# Altium schematic sheet FPGA_BANKS.SchDoc
size A3; Organization: ICNS, MARCS Institute; Address1: Werrington South Campus, Great Western Highway; Address2: Werrington, NSW, 2747; SheetNumber: 5; SheetTotal: 16
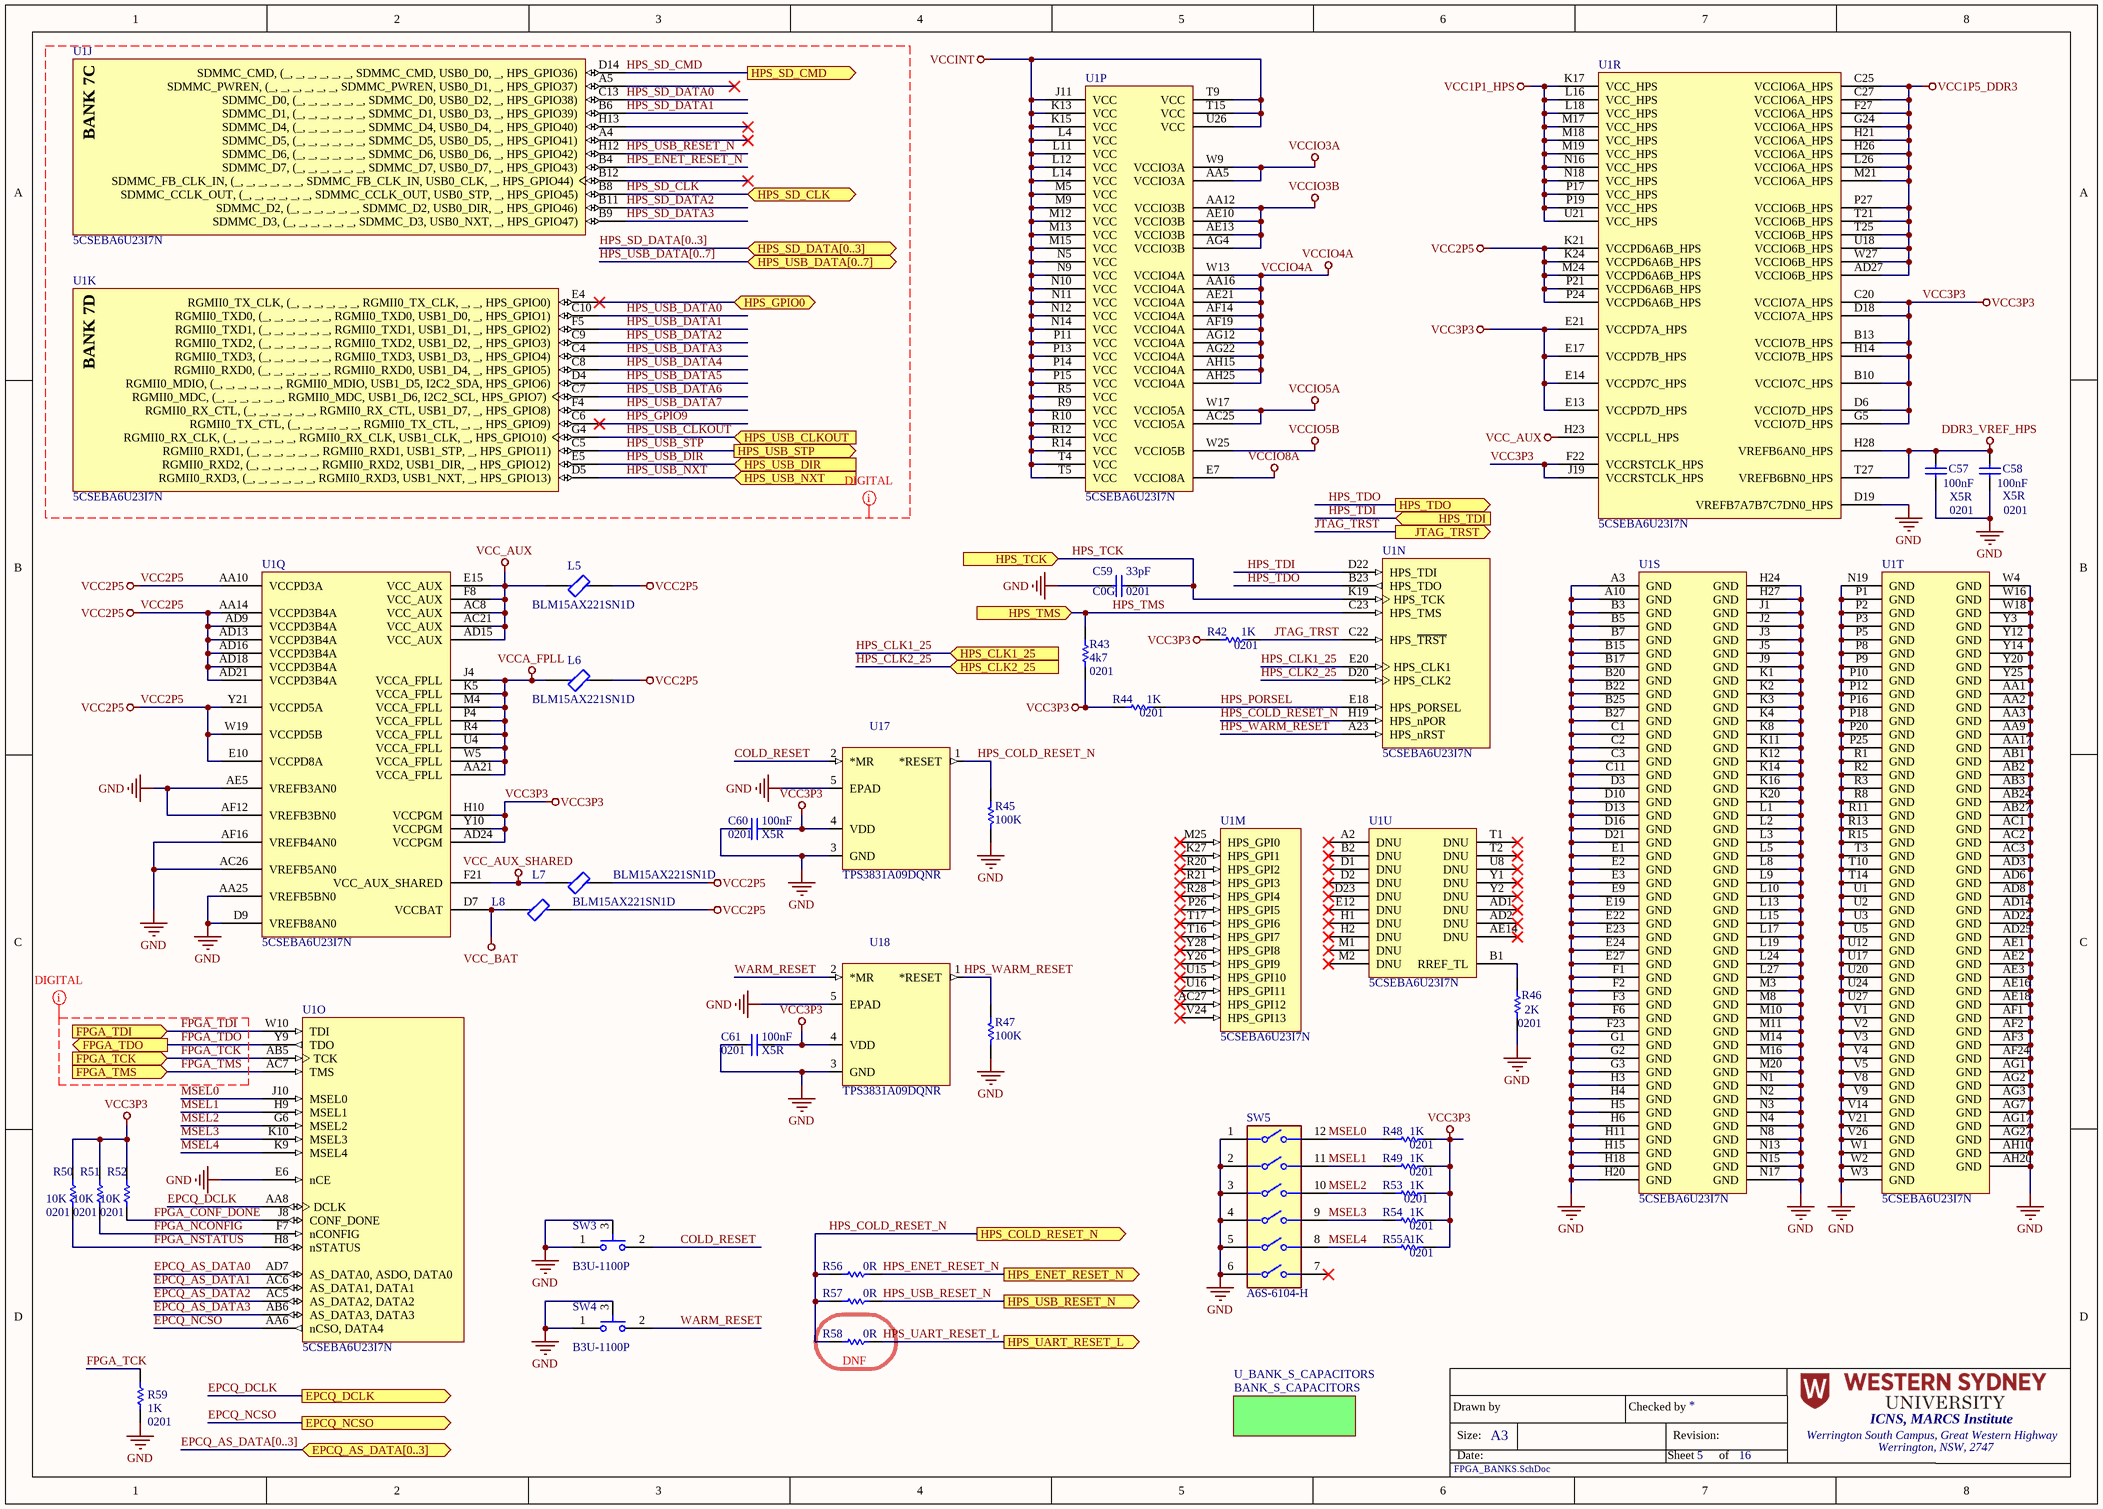
[diagram p0: FPGA_BANKS.SchDoc]

## Parts
C57  Capacitance: 100nF  Case Code (Imperial): 0201  Dielectric: X5R  [CAP 0201 (0603)]  (hidden comment: CL03A104KP3NNNC)
C58  Capacitance: 100nF  Case Code (Imperial): 0201  Dielectric: X5R  [CAP 0201 (0603)]  (hidden comment: CL03A104KP3NNNC)
C59  Capacitance: 33pF  Case Code (Imperial): 0201  Dielectric: C0G  [CAP 0201 (0603)]  (hidden comment: CGA1A2C0G1E330J030BA)
C60  Capacitance: 100nF  Case Code (Imperial): 0201  Dielectric: X5R  [CAP 0201 (0603)]  (hidden comment: CL03A104KP3NNNC)
C61  Capacitance: 100nF  Case Code (Imperial): 0201  Dielectric: X5R  [CAP 0201 (0603)]  (hidden comment: CL03A104KP3NNNC)
L5  BLM15AX221SN1D  [FP-BLM15-0_05-IPC_C]
L6  BLM15AX221SN1D  [FP-BLM15-0_05-IPC_C]
L7  BLM15AX221SN1D  [FP-BLM15-0_05-IPC_C]
L8  BLM15AX221SN1D  [FP-BLM15-0_05-IPC_C]
R42  value 1K  Case Code (Imperial): 0201  [RES 0201 (0603)]  (hidden comment: AC0201FR-071KL)
R43  value 4k7  Case Code (Imperial): 0201  [RES 0201 (0603)]  (hidden comment: AC0201FR-074K7L)
R44  value 1K  Case Code (Imperial): 0201  [RES 0201 (0603)]  (hidden comment: AC0201FR-071KL)
R45  value 100K  [RES 0402 (1005)]  (hidden comment: CRCW0402100KFKEDHP)
R46  value 2K  Case Code (Imperial): 0201  [RES 0201 (0603)]  (hidden comment: CRCW02012K00FKED)
R47  value 100K  [RES 0402 (1005)]  (hidden comment: CRCW0402100KFKEDHP)
R48  value 1K  Case Code (Imperial): 0201  [RES 0201 (0603)]  (hidden comment: AC0201FR-071KL)
R49  value 1K  Case Code (Imperial): 0201  [RES 0201 (0603)]  (hidden comment: AC0201FR-071KL)
R50  value 10K  Case Code (Imperial): 0201  [RES 0201 (0603)]  (hidden comment: AC0201FR-0710KL)
R51  value 10K  Case Code (Imperial): 0201  [RES 0201 (0603)]  (hidden comment: AC0201FR-0710KL)
R52  value 10K  Case Code (Imperial): 0201  [RES 0201 (0603)]  (hidden comment: AC0201FR-0710KL)
R53  value 1K  Case Code (Imperial): 0201  [RES 0201 (0603)]  (hidden comment: AC0201FR-071KL)
R54  value 1K  Case Code (Imperial): 0201  [RES 0201 (0603)]  (hidden comment: AC0201FR-071KL)
R55A  value 1K  Case Code (Imperial): 0201  [RES 0201 (0603)]  (hidden comment: AC0201FR-071KL)
R56  value 0R  [RES 0201 (0603)]  (hidden comment: AF0201JR-070RL)
R57  value 0R  [RES 0201 (0603)]  (hidden comment: AF0201JR-070RL)
R58  value 0R  [RES 0201 (0603)]  (hidden comment: AF0201JR-070RL)
R59  value 1K  Case Code (Imperial): 0201  [RES 0201 (0603)]  (hidden comment: AC0201FR-071KL)
SW3  B3U-1100P  [FP-B3U-1100P-MFG]
SW4  B3U-1100P  [FP-B3U-1100P-MFG]
SW5  A6S-6104-H  [FP-A6S-6104-H-MFG]
U1  5CSEBA6U23I7N  [ALTR-UBGA672_A-185]  (parts J,K,M,N,O,P,Q,R,S,T,U of 21)
U17  TPS3831A09DQNR  [DQN0004A_TEX]
U18  TPS3831A09DQNR  [DQN0004A_TEX]

## Blocks framed on the sheet
DNF: R58

## Sub-sheets
U_BANK_S_CAPACITORS = BANK_S_CAPACITORS: no entries

## Ports
EPCQ_AS_DATA[0..3] (bidir), EPCQ_DCLK (out), EPCQ_NCSO (out), FPGA_TCK (in), FPGA_TDI (in), FPGA_TDO (out), FPGA_TMS (in), HPS_CLK1_25 (in), HPS_CLK2_25 (in), HPS_COLD_RESET_N (out), HPS_ENET_RESET_N (out), HPS_GPIO0 (bidir), HPS_SD_CLK (bidir), HPS_SD_CMD (out), HPS_SD_DATA[0..3] (bidir), HPS_TCK (in), HPS_TDI (in), HPS_TDO (out), HPS_TMS (in), HPS_UART_RESET_L (out), HPS_USB_CLKOUT (in), HPS_USB_DATA[0..7] (bidir), HPS_USB_DIR (in), HPS_USB_NXT (in), HPS_USB_RESET_N (out), HPS_USB_STP (out), JTAG_TRST (out)

## Nets
DDR3_VREF_HPS: C57.2 C58.2 U1.H28(VREFB6AN0_HPS) U1.T27(VREFB6BN0_HPS)
GND: C57.1 C58.1 C59.2 C60.1 C61.1 R45.1 R46.2 R47.1 R59.2 SW3.1 SW3.3 SW4.1 SW4.3 SW5.1 SW5.2 SW5.3 SW5.4 SW5.5 SW5.6 U1.A3(GND) U1.A10(GND) U1.AA1(GND) U1.AA2(GND) U1.AA3(GND) U1.AA9(GND) U1.AA17(GND) U1.AA25(VREFB5BN0) U1.AB1(GND) U1.AB2(GND) U1.AB3(GND) U1.AB24(GND) U1.AB27(GND) U1.AC1(GND) U1.AC2(GND) U1.AC3(GND) U1.AC26(VREFB5AN0) U1.AD3(GND) U1.AD6(GND) U1.AD8(GND) U1.AD14(GND) U1.AD22(GND) U1.AD25(GND) U1.AE1(GND) U1.AE2(GND) U1.AE3(GND) U1.AE5(VREFB3AN0) U1.AE16(GND) U1.AE18(GND) U1.AF1(GND) U1.AF2(GND) U1.AF3(GND) U1.AF12(VREFB3BN0) U1.AF16(VREFB4AN0) U1.AF24(GND) U1.AG1(GND) U1.AG2(GND) U1.AG3(GND) U1.AG7(GND) U1.AG17(GND) U1.AG27(GND) U1.AH10(GND) U1.AH20(GND) U1.B3(GND) U1.B5(GND) U1.B7(GND) U1.B15(GND) U1.B17(GND) U1.B20(GND) U1.B22(GND) U1.B25(GND) U1.B27(GND) U1.C1(GND) U1.C2(GND) U1.C3(GND) U1.C11(GND) U1.D3(GND) U1.D9(VREFB8AN0) U1.D10(GND) U1.D13(GND) U1.D16(GND) U1.D19(VREFB7A7B7C7DN0_HPS) U1.D21(GND) U1.E1(GND) U1.E2(GND) U1.E3(GND) U1.E6(nCE) U1.E9(GND) U1.E19(GND) U1.E22(GND) U1.E23(GND) U1.E24(GND) U1.E27(GND) U1.F1(GND) U1.F2(GND) U1.F3(GND) U1.F6(GND) U1.F23(GND) U1.G1(GND) U1.G2(GND) U1.G3(GND) U1.H3(GND) U1.H4(GND) U1.H5(GND) U1.H6(GND) U1.H11(GND) U1.H15(GND) U1.H18(GND) U1.H20(GND) U1.H24(GND) U1.H27(GND) U1.J1(GND) U1.J2(GND) U1.J3(GND) U1.J5(GND) U1.J9(GND) U1.K1(GND) U1.K2(GND) U1.K3(GND) U1.K4(GND) U1.K8(GND) U1.K11(GND) U1.K12(GND) U1.K14(GND) U1.K16(GND) U1.K20(GND) U1.L1(GND) U1.L2(GND) U1.L3(GND) U1.L5(GND) U1.L8(GND) U1.L9(GND) U1.L10(GND) U1.L13(GND) U1.L15(GND) U1.L17(GND) U1.L19(GND) U1.L24(GND) U1.L27(GND) U1.M3(GND) U1.M8(GND) U1.M10(GND) U1.M11(GND) U1.M14(GND) U1.M16(GND) U1.M20(GND) U1.N1(GND) U1.N2(GND) U1.N3(GND) U1.N4(GND) U1.N8(GND) U1.N13(GND) U1.N15(GND) U1.N17(GND) U1.N19(GND) U1.P1(GND) U1.P2(GND) U1.P3(GND) U1.P5(GND) U1.P8(GND) U1.P9(GND) U1.P10(GND) U1.P12(GND) U1.P16(GND) U1.P18(GND) U1.P20(GND) U1.P25(GND) U1.R1(GND) U1.R2(GND) U1.R3(GND) U1.R8(GND) U1.R11(GND) U1.R13(GND) U1.R15(GND) U1.T3(GND) U1.T10(GND) U1.T14(GND) U1.U1(GND) U1.U2(GND) U1.U3(GND) U1.U5(GND) U1.U12(GND) U1.U17(GND) U1.U20(GND) U1.U24(GND) U1.U27(GND) U1.V1(GND) U1.V2(GND) U1.V3(GND) U1.V4(GND) U1.V5(GND) U1.V8(GND) U1.V9(GND) U1.V14(GND) U1.V21(GND) U1.V26(GND) U1.W1(GND) U1.W2(GND) U1.W3(GND) U1.W4(GND) U1.W16(GND) U1.W18(GND) U1.Y3(GND) U1.Y12(GND) U1.Y14(GND) U1.Y20(GND) U1.Y25(GND) U17.3(GND) U17.5(EPAD) U18.3(GND) U18.5(EPAD)
VCC1P1_HPS: U1.K17(VCC_HPS) U1.L16(VCC_HPS) U1.L18(VCC_HPS) U1.M17(VCC_HPS) U1.M18(VCC_HPS) U1.M19(VCC_HPS) U1.N16(VCC_HPS) U1.N18(VCC_HPS) U1.P17(VCC_HPS) U1.P19(VCC_HPS) U1.U21(VCC_HPS)
VCC1P5_DDR3: U1.AD27(VCCIO6B_HPS) U1.C25(VCCIO6A_HPS) U1.C27(VCCIO6A_HPS) U1.F27(VCCIO6A_HPS) U1.G24(VCCIO6A_HPS) U1.H21(VCCIO6A_HPS) U1.H26(VCCIO6A_HPS) U1.L26(VCCIO6A_HPS) U1.M21(VCCIO6A_HPS) U1.P27(VCCIO6B_HPS) U1.T21(VCCIO6B_HPS) U1.T25(VCCIO6B_HPS) U1.U18(VCCIO6B_HPS) U1.W27(VCCIO6B_HPS)
VCC2P5: L5.2 L6.2 L7.2 L8.2 U1.AA10(VCCPD3A) U1.AA14(VCCPD3B4A) U1.AD9(VCCPD3B4A) U1.AD13(VCCPD3B4A) U1.AD16(VCCPD3B4A) U1.AD18(VCCPD3B4A) U1.AD21(VCCPD3B4A) U1.E10(VCCPD8A) U1.K21(VCCPD6A6B_HPS) U1.K24(VCCPD6A6B_HPS) U1.M24(VCCPD6A6B_HPS) U1.P21(VCCPD6A6B_HPS) U1.P24(VCCPD6A6B_HPS) U1.W19(VCCPD5B) U1.Y21(VCCPD5A)
VCC3P3: C60.2 C61.2 R42.1 R43.2 R44.1 R48.2 R49.2 R50.2 R51.2 R52.2 R53.2 R54.2 R55A.2 U1.AD24(VCCPGM) U1.B10(VCCIO7C_HPS) U1.B13(VCCIO7B_HPS) U1.C20(VCCIO7A_HPS) U1.D6(VCCIO7D_HPS) U1.D18(VCCIO7A_HPS) U1.E13(VCCPD7D_HPS) U1.E14(VCCPD7C_HPS) U1.E17(VCCPD7B_HPS) U1.E21(VCCPD7A_HPS) U1.F22(VCCRSTCLK_HPS) U1.G5(VCCIO7D_HPS) U1.H10(VCCPGM) U1.H14(VCCIO7B_HPS) U1.J19(VCCRSTCLK_HPS) U1.Y10(VCCPGM) U17.4(VDD) U18.4(VDD)
VCC_AUX: L5.1 U1.AC8(VCC_AUX) U1.AC21(VCC_AUX) U1.AD15(VCC_AUX) U1.E15(VCC_AUX) U1.F8(VCC_AUX) U1.H23(VCCPLL_HPS)
VCC_AUX_SHARED: L7.1 U1.F21(VCC_AUX_SHARED)
VCC_BAT: L8.1 U1.D7(VCCBAT)
VCCA_FPLL: L6.1 U1.AA21(VCCA_FPLL) U1.J4(VCCA_FPLL) U1.K5(VCCA_FPLL) U1.M4(VCCA_FPLL) U1.P4(VCCA_FPLL) U1.R4(VCCA_FPLL) U1.U4(VCCA_FPLL) U1.W5(VCCA_FPLL)
VCCINT: U1.J11(VCC) U1.K13(VCC) U1.K15(VCC) U1.L4(VCC) U1.L11(VCC) U1.L12(VCC) U1.L14(VCC) U1.M5(VCC) U1.M9(VCC) U1.M12(VCC) U1.M13(VCC) U1.M15(VCC) U1.N5(VCC) U1.N9(VCC) U1.N10(VCC) U1.N11(VCC) U1.N12(VCC) U1.N14(VCC) U1.P11(VCC) U1.P13(VCC) U1.P14(VCC) U1.P15(VCC) U1.R5(VCC) U1.R9(VCC) U1.R10(VCC) U1.R12(VCC) U1.R14(VCC) U1.T4(VCC) U1.T5(VCC) U1.T9(VCC) U1.T15(VCC) U1.U26(VCC)
VCCIO3A: U1.AA5(VCCIO3A) U1.W9(VCCIO3A)
VCCIO3B: U1.AA12(VCCIO3B) U1.AE10(VCCIO3B) U1.AE13(VCCIO3B) U1.AG4(VCCIO3B)
VCCIO4A: U1.AA16(VCCIO4A) U1.AE21(VCCIO4A) U1.AF14(VCCIO4A) U1.AF19(VCCIO4A) U1.AG12(VCCIO4A) U1.AG22(VCCIO4A) U1.AH15(VCCIO4A) U1.AH25(VCCIO4A) U1.W13(VCCIO4A)
VCCIO5A: U1.AC25(VCCIO5A) U1.W17(VCCIO5A)
VCCIO5B: U1.W25(VCCIO5B)
VCCIO8A: U1.E7(VCCIO8A)
COLD_RESET: SW3.2 U17.2(*MR)
EPCQ_AS_DATA0: U1.AD7(AS_DATA0,_ASDO,_DATA0)
EPCQ_AS_DATA1: U1.AC6(AS_DATA1,_DATA1)
EPCQ_AS_DATA2: U1.AC5(AS_DATA2,_DATA2)
EPCQ_AS_DATA3: U1.AB6(AS_DATA3,_DATA3)
EPCQ_DCLK: U1.AA8(DCLK) ; port EPCQ_DCLK
EPCQ_NCSO: U1.AA6(nCSO,_DATA4) ; port EPCQ_NCSO
FPGA_CONF_DONE: R52.1 U1.J8(CONF_DONE)
FPGA_NCONFIG: R51.1 U1.F7(nCONFIG)
FPGA_NSTATUS: R50.1 U1.H8(nSTATUS)
FPGA_TCK: R59.1 U1.AB5(TCK) ; port FPGA_TCK
FPGA_TDI: U1.W10(TDI) ; port FPGA_TDI
FPGA_TDO: U1.Y9(TDO) ; port FPGA_TDO
FPGA_TMS: U1.AC7(TMS) ; port FPGA_TMS
HPS_CLK1_25: U1.E20(HPS_CLK1) ; port HPS_CLK1_25
HPS_CLK2_25: U1.D20(HPS_CLK2) ; port HPS_CLK2_25
HPS_COLD_RESET_N: R45.2 R56.1 R57.1 R58.1 U1.H19(HPS_nPOR) U17.1(*RESET) ; port HPS_COLD_RESET_N
HPS_ENET_RESET_N: R56.2 U1.B4(SDMMC_D7,_(_,__,__,__,__,__,_SDMMC_D7,_USB0_D7,__,_HPS_GPIO43)) ; port HPS_ENET_RESET_N
HPS_GPIO0: U1.E4(RGMII0_TX_CLK,_(_,__,__,__,__,__,_RGMII0_TX_CLK,__,__,_HPS_GPIO0)) ; port HPS_GPIO0
HPS_GPIO9: U1.C6(RGMII0_TX_CTL,_(_,__,__,__,__,__,_RGMII0_TX_CTL,__,__,_HPS_GPIO9))
HPS_PORSEL: R44.2 U1.E18(HPS_PORSEL)
HPS_SD_CLK: U1.B8(SDMMC_CCLK_OUT,_(_,__,__,__,__,__,_SDMMC_CCLK_OUT,_USB0_STP,__,_HPS_GPIO45)) ; port HPS_SD_CLK
HPS_SD_CMD: U1.D14(SDMMC_CMD,_(_,__,__,__,__,__,_SDMMC_CMD,_USB0_D0,__,_HPS_GPIO36)) ; port HPS_SD_CMD
HPS_SD_DATA0: U1.C13(SDMMC_D0,_(_,__,__,__,__,__,_SDMMC_D0,_USB0_D2,__,_HPS_GPIO38))
HPS_SD_DATA1: U1.B6(SDMMC_D1,_(_,__,__,__,__,__,_SDMMC_D1,_USB0_D3,__,_HPS_GPIO39))
HPS_SD_DATA2: U1.B11(SDMMC_D2,_(_,__,__,__,__,__,_SDMMC_D2,_USB0_DIR,__,_HPS_GPIO46))
HPS_SD_DATA3: U1.B9(SDMMC_D3,_(_,__,__,__,__,__,_SDMMC_D3,_USB0_NXT,__,_HPS_GPIO47))
HPS_TCK: C59.1 U1.K19(HPS_TCK) ; port HPS_TCK
HPS_TDI: U1.D22(HPS_TDI) ; port HPS_TDI
HPS_TDO: U1.B23(HPS_TDO) ; port HPS_TDO
HPS_TMS: R43.1 U1.C23(HPS_TMS) ; port HPS_TMS
HPS_UART_RESET_L: R58.2 ; port HPS_UART_RESET_L
HPS_USB_CLKOUT: U1.G4(RGMII0_RX_CLK,_(_,__,__,__,__,__,_RGMII0_RX_CLK,_USB1_CLK,__,_HPS_GPIO10)) ; port HPS_USB_CLKOUT
HPS_USB_DATA0: U1.C10(RGMII0_TXD0,_(_,__,__,__,__,__,_RGMII0_TXD0,_USB1_D0,__,_HPS_GPIO1))
HPS_USB_DATA1: U1.F5(RGMII0_TXD1,_(_,__,__,__,__,__,_RGMII0_TXD1,_USB1_D1,__,_HPS_GPIO2))
HPS_USB_DATA2: U1.C9(RGMII0_TXD2,_(_,__,__,__,__,__,_RGMII0_TXD2,_USB1_D2,__,_HPS_GPIO3))
HPS_USB_DATA3: U1.C4(RGMII0_TXD3,_(_,__,__,__,__,__,_RGMII0_TXD3,_USB1_D3,__,_HPS_GPIO4))
HPS_USB_DATA4: U1.C8(RGMII0_RXD0,_(_,__,__,__,__,__,_RGMII0_RXD0,_USB1_D4,__,_HPS_GPIO5))
HPS_USB_DATA5: U1.D4(RGMII0_MDIO,_(_,__,__,__,__,__,_RGMII0_MDIO,_USB1_D5,_I2C2_SDA,_HPS_GPIO6))
HPS_USB_DATA6: U1.C7(RGMII0_MDC,_(_,__,__,__,__,__,_RGMII0_MDC,_USB1_D6,_I2C2_SCL,_HPS_GPIO7))
HPS_USB_DATA7: U1.F4(RGMII0_RX_CTL,_(_,__,__,__,__,__,_RGMII0_RX_CTL,_USB1_D7,__,_HPS_GPIO8))
HPS_USB_DIR: U1.E5(RGMII0_RXD2,_(_,__,__,__,__,__,_RGMII0_RXD2,_USB1_DIR,__,_HPS_GPIO12)) ; port HPS_USB_DIR
HPS_USB_NXT: U1.D5(RGMII0_RXD3,_(_,__,__,__,__,__,_RGMII0_RXD3,_USB1_NXT,__,_HPS_GPIO13)) ; port HPS_USB_NXT
HPS_USB_RESET_N: R57.2 U1.H12(SDMMC_D6,_(_,__,__,__,__,__,_SDMMC_D6,_USB0_D6,__,_HPS_GPIO42)) ; port HPS_USB_RESET_N
HPS_USB_STP: U1.C5(RGMII0_RXD1,_(_,__,__,__,__,__,_RGMII0_RXD1,_USB1_STP,__,_HPS_GPIO11)) ; port HPS_USB_STP
HPS_WARM_RESET: R47.2 U1.A23(HPS_nRST) U18.1(*RESET)
JTAG_TRST: R42.2 U1.C22(HPS_~{TRST}) ; port JTAG_TRST
MSEL0: R48.1 SW5.12 U1.J10(MSEL0)
MSEL1: R49.1 SW5.11 U1.H9(MSEL1)
MSEL2: R53.1 SW5.10 U1.G6(MSEL2)
MSEL3: R54.1 SW5.9 U1.K10(MSEL3)
MSEL4: R55A.1 SW5.8 U1.K9(MSEL4)
WARM_RESET: SW4.2 U18.2(*MR)
NetR46_1: R46.1 U1.B1(RREF_TL)

Not connected (* = marked no-connect by the designer): SW5 7*; U1 A2(DNU)* A4(SDMMC_D5,_(_,__,__,__,__,__,_SDMMC_D5,_USB0_D5,__,_HPS_GPIO41))* A5(SDMMC_PWREN,_(_,__,__,__,__,__,_SDMMC_PWREN,_USB0_D1,__,_HPS_GPIO37))* AC27(HPS_GPI12)* AD1(DNU)* AD2(DNU)* AE14(DNU)* B2(DNU)* B12(SDMMC_FB_CLK_IN,_(_,__,__,__,__,__,_SDMMC_FB_CLK_IN,_USB0_CLK,__,_HPS_GPIO44))* D1(DNU)* D2(DNU)* D23(DNU)* E12(DNU)* H1(DNU)* H2(DNU)* H13(SDMMC_D4,_(_,__,__,__,__,__,_SDMMC_D4,_USB0_D4,__,_HPS_GPIO40))* K27(HPS_GPI1)* M1(DNU)* M2(DNU)* M25(HPS_GPI0)* P26(HPS_GPI5)* R20(HPS_GPI2)* R21(HPS_GPI3)* R28(HPS_GPI4)* T1(DNU)* T2(DNU)* T16(HPS_GPI7)* T17(HPS_GPI6)* U8(DNU)* U15(HPS_GPI10)* U16(HPS_GPI11)* V24(HPS_GPI13)* Y1(DNU)* Y2(DNU)* Y26(HPS_GPI9)* Y28(HPS_GPI8)*

## Buses and harness runs
bus EPCQ_AS_DATA[0..3] = port EPCQ_AS_DATA[0..3]
bus HPS_SD_DATA[0..3] = port HPS_SD_DATA[0..3]
bus HPS_USB_DATA[0..7] = port HPS_USB_DATA[0..7]

## Layout directives
net class DIGITAL: FPGA_TCK, FPGA_TDI, FPGA_TDO, FPGA_TMS, HPS_ENET_RESET_N, HPS_GPIO9, HPS_SD_CLK, HPS_SD_CMD, HPS_SD_DATA0, HPS_SD_DATA1, HPS_SD_DATA2, HPS_SD_DATA3, HPS_SD_DATA[0..3], HPS_USB_CLKOUT, HPS_USB_DATA0, HPS_USB_DATA1, HPS_USB_DATA2, HPS_USB_DATA3, HPS_USB_DATA4, HPS_USB_DATA5, HPS_USB_DATA6, HPS_USB_DATA7, HPS_USB_DATA[0..7], HPS_USB_DIR, HPS_USB_NXT, HPS_USB_RESET_N, HPS_USB_STP

## Notes on the sheet
- Drawn by
- Size:
- Date:
- A3
- Checked by
- Sheet
- Revision:
- of
- (in symbol CMP-005-000007-1, part J) BANK 7C
- (in symbol CMP-005-000007-1, part K) BANK 7D

## Library data of the parts
C57 C58 C60 C61 = CMP-003-000014-1: Cap Ceramic 0.1uF 10V X5R 10% Pad SMD 0201 85C T/R; Manufacturer: Samsung; RoHS: Yes; Manufacturer Part Number: CL03A104KP3NNNC; Tolerance: 10%; Height: 0.3mm; ComponentLink2Description: https://datasheet.ciiva.com/26838/getdatasheetpartid-357484-26838083.pdf?src-supplier=Verical; ComponentLink2URL: https://datasheet.ciiva.com/26838/getdatasheetpartid-357484-26838083.pdf?src-supplier=Verical; Lead Free: Lead Free; Category: Ceramic Capacitors; Voltage Rating: 10V; Value: 0.1uF; Source: ICNS_PropheseeLib.SchLib; Depth: 0.3mm; Mount: Surface Mount; Stock 1: 12175; Package Quantity: 1; Packaging: Tape and Reel; ComponentLink1Description: https://datasheet.ciiva.com/25803/cl03a104kp3nnnc-25803204.pdf?src-supplier=Digi-Key; Case Code (Metric): 0603; Width: 0.012inch; Length: 0.6mm; Radiation Hardening: No; Series: CL; Thickness: 0.013inch; Max Operating Temperature: 85°C; Design Item ID: CL03A104KP3NNNC; Voltage Rating (DC): 10V; Case/Package: 0201; Contact Plating: Tin; Min Operating Temperature: -55°C; Construction: Flat; Pricing 1: 1=0.10000, 10=0.02900, 50=0.01600, 100=0.01300, 500=0.00932, 1000=0.00732, 2500=0.00666, 5000=0.00612 (USD); ComponentLink1URL: https://datasheet.ciiva.com/25803/cl03a104kp3nnnc-25803204.pdf?src-supplier=Digi-Key
C59 = CMP-003-000013-1: Cap Ceramic 33 pF 25V ±5% C0G, NP0 0201 (0603 Metric); Manufacturer: TDK; Value: 33pF; Category: Ceramic Capacitors; Height: 0.3mm; Tolerance: 5%; RoHS: Yes; Manufacturer Part Number: CGA1A2C0G1E330J030BA; Voltage Rating: 25V; Package Quantity: 1; Weight: 6E-06oz; Packaging: Tape and Reel; RoHS Compliant: Yes; Length: 0.6mm; Mount: Surface Mount; Pricing 1: 1=0.11000, 10=0.08000, 50=0.04360, 100=0.03560, 500=0.02540, 1000=0.01996, 2500=0.01815, 5000=0.01670 (USD); Design Item ID: CGA1A2C0G1E330J030BA; ComponentLink1Description: https://datasheet.ciiva.com/24223/cga1a2c0g1e330j030ba-272981-24223848.pdf?src-supplier=Mouser; Min Operating Temperature: -55°C; Ratings: AEC-Q200; Stock 1: 26669; Max Operating Temperature: 125°C; Voltage Rating (DC): 25V; Series: CGA; ComponentLink1URL: https://datasheet.ciiva.com/24223/cga1a2c0g1e330j030ba-272981-24223848.pdf?src-supplier=Mouser; Source: ICNS_PropheseeLib.SchLib; Case Code (Metric): 0603; Thickness: 0.013inch; Width: 0.012inch; Depth: 0.3mm; Termination: SMD/SMT; Case/Package: 0201; Resistor Type: Ceramic
L5-L8 = CMP-005-000015-2: Ferrite Bead Multi-Layer 220 Ohms @ 100 MHz 0402 (1005 Metric) 600mA 180mOhm; Manufacturer: Murata; DC Resistance (DCR): 180mR; Number of Lines: 1; Material: Ferrite,Steel; Impedance: 220R; Test Frequency: 100MHz; Tolerance: 25%; Packaging: Tape and Reel; Case Code (Imperial): 0402; Current Rating: 600mA; Max Current Rating: 600mA; Min Operating Temperature: -55°C; Length: 1mm; Lead Free: Lead Free; Number of Circuits: 1; Package Quantity: 1; Max Operating Temperature: 125°C; Termination: SMD/SMT; Width: 0.5mm; REACH SVHC: No SVHC; Case/Package: 0402; Number of Pins: 2; Height: 0.5mm; Case Code (Metric): 1005; Max DC Current: 600mA; Depth: 0.5mm; DC Resistance-Max: 180MR; RoHS Compliant: Yes; Series: BLM15AX_SN; ComponentLink5URL: https://datasheet.ciiva.com/16420/l0110s0100blm15ax-sn-16420779.pdf?src-supplier=Future+Electronics; ComponentLink1Description: https://datasheet.ciiva.com/41449/001172168-da-01-en-drossel-0402-220r-1-0x0-5mm-10000st-41449455.pdf?src-supplier=Conrad; ComponentLink5Description: https://datasheet.ciiva.com/16420/l0110s0100blm15ax-sn-16420779.pdf?src-supplier=Future+Electronics; Design Item ID: BLM15AX221SN1D; ComponentLink3URL: https://datasheet.ciiva.com/1012/l0110e-1012305.pdf?src-supplier=Digi-Key; ComponentLink4URL: https://datasheet.ciiva.com/1012/l0110e-1012307.pdf?src-supplier=Digi-Key; RoHS: Yes; ComponentLink2Description: https://datasheet.ciiva.com/1012/l0110e-1012306.pdf?src-supplier=Digi-Key; Manufacturer Part Number: BLM15AX221SN1D; Pricing 1: 1=0.06640, 10=0.03530, 25=0.03490, 100=0.02120, 250=0.02100, 500=0.01870, 1000=0.01580, 3000=0.01510, 6000=0.01500, 15000=0.01490, 30000=0.01480 (USD); ComponentLink1URL: https://datasheet.ciiva.com/41449/001172168-da-01-en-drossel-0402-220r-1-0x0-5mm-10000st-41449455.pdf?src-supplier=Conrad; Source: ICNS_PropheseeLib.SchLib; ComponentLink3Description: https://datasheet.ciiva.com/1012/l0110e-1012305.pdf?src-supplier=Digi-Key; ComponentLink2URL: https://datasheet.ciiva.com/1012/l0110e-1012306.pdf?src-supplier=Digi-Key; ComponentLink4Description: https://datasheet.ciiva.com/1012/l0110e-1012307.pdf?src-supplier=Digi-Key; Stock 1: 29113; Category: Inductors
R42 R44 R48 R49 R53 R54 R55A R59 = CMP-006-000019-1: Res Thick Film 0201 1K Ohm 1% 0.05W(1/20W) ±200ppm/C Pad SMD Automotive T/R; Manufacturer: Yageo; Temperature Coefficient: 200ppm/°C; Max Power Dissipation: 50mW; Resistance: 1kR; Case Code (Metric): 0603; Width: 0.012inch; ComponentLink1Description: http://www.yageo.com/NewPortal/yageodocoutput?fileName=/pdf/R-Chip/PYu-AC_51_RoHS_L_6.pdf&src-supplier=Digi-Key; Tolerance: 1%; Source: ICNS_PropheseeLib.SchLib; Manufacturer Part Number: AC0201FR-071KL; Resistor Type: Thick Film; ComponentLink1URL: http://www.yageo.com/NewPortal/yageodocoutput?fileName=/pdf/R-Chip/PYu-AC_51_RoHS_L_6.pdf&src-supplier=Digi-Key; Packaging: Tape and Reel; Max Operating Temperature: 155°C; Min Operating Temperature: -55°C; Height: 0.01inch; Pricing 1: 1=0.10000, 10=0.06600, 100=0.02670, 1000=0.01201, 2500=0.01042, 5000=0.00861 (USD); Case/Package: 0201; Category: Chip SMD Resistors; Stock 1: 200; Length: 0.024inch; Design Item ID: AC0201FR-071KL; Features: Moisture Resistant,Automotive AEC-Q200; RoHS: Yes; Number of Terminations: 2
R43 = CMP-006-000022-1: Res Thick Film 0201 4.7K Ohm 1% 1/20W ±200ppm/°C Molded SMD Paper T/R; Manufacturer: Yageo; Max Power Dissipation: 50mW; Resistance: 4.7kR; Number of Terminations: 2; Packaging: Tape and Reel; RoHS: Yes; Temperature Coefficient: 200ppm/°C; Case Code (Metric): 0603; Features: Moisture Resistant,Automotive AEC-Q200; Source: ICNS_PropheseeLib.SchLib; Case/Package: 0201; Pricing 1: 1=0.10000, 10=0.06600, 100=0.02670, 1000=0.01201, 2500=0.01042, 5000=0.00861 (USD); Min Operating Temperature: -55°C; Length: 0.024inch; Stock 1: 267560; ComponentLink1URL: http://www.yageo.com/NewPortal/yageodocoutput?fileName=/pdf/R-Chip/PYu-AC_51_RoHS_L_6.pdf&src-supplier=Digi-Key; Height: 0.01inch; Manufacturer Part Number: AC0201FR-074K7L; Lead Free: Lead Free; ComponentLink1Description: http://www.yageo.com/NewPortal/yageodocoutput?fileName=/pdf/R-Chip/PYu-AC_51_RoHS_L_6.pdf&src-supplier=Digi-Key; Design Item ID: AC0201FR-074K7L; Width: 0.012inch; Category: Chip SMD Resistors; Resistor Type: Thick Film; Tolerance: 1%; Max Operating Temperature: 155°C
R45 R47 = CMP-006-000009-1: Res Thick Film 0402 100K Ohm 1% 0.2W(1/5W) ±100ppm/C Pad SMD Automotive T/R; Manufacturer 1: Vishay Dale; Resistance: 100kR; Temperature Coefficient: 100ppm/°C; Max Power Dissipation: 125mW; Voltage Rating (DC): 50V; ComponentLink1URL: https://datasheet.ciiva.com/2498/crcwhpe3-2498716.pdf?src-supplier=Digi-Key; ComponentLink5URL: https://datasheet.ciiva.com/48525/crcwhpe3-48525582.pdf?src-supplier=Avnet; Tolerance: 1%; Height: 0.3mm; Features: Automotive AEC-Q200; Mount: Surface Mount; RoHS: Yes; Series: CRCW-HP; Lead Free: Lead Free; REACH SVHC: Unknown; Case Code (Metric): 1005; ComponentLink7Description: https://datasheet.ciiva.com/46441/1703058-46441599.pdf?src-supplier=Element14; RoHS Compliant: Yes; Weight: 2.3E-05oz; Packaging: Tape and Reel; Min Operating Temperature: -55°C; Width: 0.02inch; Package Quantity: 10; ComponentLink3URL: https://datasheet.ciiva.com/2498/crcwhpe3-2498718.pdf?src-supplier=Digi-Key; Design Item ID: CRCW0402100KFKEDHP; ComponentLink4Description: https://datasheet.ciiva.com/8982/crcwhpe3-8982553.pdf?src-supplier=Avnet; Resistor Type: Thick Film; Contact Plating: Tin; ComponentLink6Description: https://datasheet.ciiva.com/5548/crcwhpe3-46056-5548557.pdf?src-supplier=Mouser; ComponentLink3Description: https://datasheet.ciiva.com/2498/crcwhpe3-2498718.pdf?src-supplier=Digi-Key; Termination: SMD/SMT; Pricing 1: 10000=0.01543 (USD); ComponentLink5Description: https://datasheet.ciiva.com/48525/crcwhpe3-48525582.pdf?src-supplier=Avnet; Length: 1mm; Max Operating Temperature: 155°C; Case Code (Imperial): 0402; ComponentLink2URL: https://datasheet.ciiva.com/2498/crcwhpe3-2498717.pdf?src-supplier=Digi-Key; ComponentLink6URL: https://datasheet.ciiva.com/5548/crcwhpe3-46056-5548557.pdf?src-supplier=Mouser; ComponentLink2Description: https://datasheet.ciiva.com/2498/crcwhpe3-2498717.pdf?src-supplier=Digi-Key; Radiation Hardening: No; Resistance Tolerance: 1%; Description 1: Res Thick Film 0402 100K Ohm 1% 0.2W(1/5W) ±100ppm/C Pad SMD Automotive T/R; ComponentLink7URL: https://datasheet.ciiva.com/46441/1703058-46441599.pdf?src-supplier=Element14; Power Rating: 125mW; Source: ICNS_PropheseeLib.SchLib; Category: Chip SMD Resistors; Voltage Rating: 50V; Number of Terminations: 2; Stock 1: 96553; Manufacturer Part Number 1: CRCW0402100KFKEDHP; ComponentLink1Description: https://datasheet.ciiva.com/2498/crcwhpe3-2498716.pdf?src-supplier=Digi-Key; ComponentLink4URL: https://datasheet.ciiva.com/8982/crcwhpe3-8982553.pdf?src-supplier=Avnet; Technology: THICK FILM; Case/Package: 0402; Depth: 0.5mm
R46 = CMP-006-000024-1: Res Thick Film 0201 2K Ohm 1% 1/20W ±100ppm/°C Molded SMD SMD Paper T/R; Manufacturer: Vishay Dale; Resistance: 2kR; Voltage Rating: 30V; Power Rating: 50mW; Pricing 1: 1=0.28000, 10=0.24000, 100=0.09400, 1000=0.03933, 2500=0.03605, 5000=0.03278 (USD); Source: ICNS_PropheseeLib.SchLib; Temperature Coefficient: 100ppm/°C; Case/Package: 0201; Case Code (Metric): 0603; Series: CRCW; Category: Chip SMD Resistors; ComponentLink1URL: https://datasheet.ciiva.com/3255/crcw0201e3-3255934.pdf?src-supplier=Avnet; Packaging: Tape and Reel; Height: 0.23mm; Max Operating Temperature: 155°C; Radiation Hardening: No; Width: 0.3mm; Resistor Type: Thick Film; Termination: SMD/SMT; Min Operating Temperature: -55°C; Design Item ID: CRCW02012K00FKED; Construction: Rectangular; Military Standard: Not; Number of Terminations: 2; Depth: 0.3mm; RoHS Compliant: Yes; Lead Free: Lead Free; Manufacturer Part Number: CRCW02012K00FKED; Tolerance: 1%; ComponentLink1Description: https://datasheet.ciiva.com/3255/crcw0201e3-3255934.pdf?src-supplier=Avnet; Stock 1: 17990; Contact Plating: Tin; Voltage Rating (DC): 30V; Length: 0.6mm; Weight: 6E-06oz; Max Power Dissipation: 50mW; RoHS: Yes
R50-R52 = CMP-006-000021-1: Res Thick Film 0201 10K Ohm 1% 0.05W(1/20W) ±200ppm/C Pad SMD Automotive T/R; Manufacturer: Yageo; Max Power Dissipation: 50mW; Resistance: 10kR; Temperature Coefficient: 200ppm/°C; Length: 0.024inch; Packaging: Tape and Reel; ComponentLink1URL: http://www.yageo.com/NewPortal/yageodocoutput?fileName=/pdf/R-Chip/PYu-AC_51_RoHS_L_6.pdf&src-supplier=Digi-Key; Number of Terminations: 2; Case/Package: 0201; Source: ICNS_PropheseeLib.SchLib; Case Code (Metric): 0603; Manufacturer Part Number: AC0201FR-0710KL; ComponentLink1Description: http://www.yageo.com/NewPortal/yageodocoutput?fileName=/pdf/R-Chip/PYu-AC_51_RoHS_L_6.pdf&src-supplier=Digi-Key; Min Operating Temperature: -55°C; Category: Chip SMD Resistors; Width: 0.012inch; RoHS: Yes; Max Operating Temperature: 155°C; Features: Moisture Resistant,Automotive AEC-Q200; Pricing 1: 1=0.10000, 10=0.06600, 100=0.02670, 1000=0.01201, 2500=0.01042, 5000=0.00861 (USD); Resistor Type: Thick Film; Stock 1: 698280; Design Item ID: AC0201FR-0710KL; Height: 0.01inch; Tolerance: 1%
R56-R58 = CMP-006-000020-1: Res Thick Film 0201 0 Ohm Sulfur Resistant Pad SMD Automotive T/R; Manufacturer: Yageo; Max Power Dissipation: 50mW; Resistance: 0mR; RoHS: Yes; Case/Package: 0201; Case Code (Metric): 0603; Case Code (Imperial): 0201; Min Operating Temperature: -55°C; Max Operating Temperature: 125°C; Number of Terminations: 2; Width: 0.012inch; ComponentLink1URL: http://www.mouser.com/ds/2/447/PYu-AF_51_RoHS_L_5-1085711.pdf?src-supplier=Mouser; ComponentLink1Description: http://www.mouser.com/ds/2/447/PYu-AF_51_RoHS_L_5-1085711.pdf?src-supplier=Mouser; ComponentLink2URL: http://www.yageo.com/documents/recent/PYu-AF_51_RoHS_L_5.pdf?src-supplier=Digi-Key; ComponentLink2Description: http://www.yageo.com/documents/recent/PYu-AF_51_RoHS_L_5.pdf?src-supplier=Digi-Key; Stock 1: 50009; Pricing 1: 1=0.11000, 10=0.09500, 25=0.06560, 50=0.05100, 100=0.03640, 250=0.02840, 500=0.02256, 1000=0.01602, 5000=0.01238 (USD); Features: Moisture Resistant,Anti-Sulfur; Package Quantity: 10000; Packaging: Tape and Reel; Length: 0.024inch; Height: 0.01inch; Termination: SMD/SMT; Design Item ID: AF0201JR-070RL; Weight: 6E-06oz; RoHS Compliant: Yes; Resistor Type: Thick Film; Source: ICNS_PropheseeLib.SchLib; Manufacturer Part Number: AF0201JR-070RL; Category: Chip SMD Resistors
SW3 SW4 = CMP-012-000002-1: Switch Tactile N.O. SPST Round Button Gull Wing 0.05A 12VDC 1.5N SMD Embossed T/R; Manufacturer: Omron; Current Rating: 50mA; Voltage Rating (DC): 12V; Electrical Life: 200000Cycles; Actuator Length: 0.4mm; Actuator Type: Standard; Switch Travel: 0.15mm; Contact Resistance: 100mR; Ratings: Dust Proof; Illumination Type: Non-Illuminated,Illuminated; Switch Function: Off-Mom; RoHS Compliant: Yes; Max Operating Temperature: 70°C; Min Operating Temperature: -25°C; Throw Configuration: SPST; Max Current Rating: 50mA; ComponentLink3URL: https://datasheet.ciiva.com/2901/b3u-1110-2901098.pdf?src-supplier=Digi-Key; ComponentLink5URL: https://datasheet.ciiva.com/22696/60838-22696216.pdf?src-supplier=Element14; Contact Plating: Silver; Design Item ID: B3U-1100P; REACH SVHC: Unknown; ComponentLink2Description: https://datasheet.ciiva.com/2901/b3u-1110-2901097.pdf?src-supplier=Digi-Key; ComponentLink9URL: https://datasheet.ciiva.com/1532/60838-1532684.pdf?src-supplier=Element14; Package Quantity: 1; Contact Current Rating: 50mA; Max Voltage Rating (DC): 12V; Mechanical Life: 200000Cycles; Length: 3.15mm; Packaging: Tape and Reel; ComponentLink8URL: https://datasheet.ciiva.com/16155/en-b3u-16155023.pdf?src-supplier=Onlinecomponents.com; ComponentLink6Description: https://datasheet.ciiva.com/14142/b3u-eng-datasheet-14142541.pdf?src-supplier=Distrelec; ComponentLink9Description: https://datasheet.ciiva.com/1532/60838-1532684.pdf?src-supplier=Element14; Source: ICNS_PropheseeLib.SchLib; ComponentLink1URL: https://datasheet.ciiva.com/1634/60838-1634404.pdf?src-supplier=Farnell; Operating Force: 1.5N; Manufacturer Part Number: B3U-1100P; Category: Tactile Switches; Series: B3U; RoHS: Yes; Lead Free: Lead Free; ComponentLink7URL: https://datasheet.ciiva.com/30197/en-b3u-30197271.pdf?src-supplier=Onlinecomponents.com; ComponentLink8Description: https://datasheet.ciiva.com/16155/en-b3u-16155023.pdf?src-supplier=Onlinecomponents.com; ComponentLink7Description: https://datasheet.ciiva.com/30197/en-b3u-30197271.pdf?src-supplier=Onlinecomponents.com; Orientation: Straight; Mount: Surface Mount; ComponentLink4Description: https://datasheet.ciiva.com/2901/b3u-1110-2901099.pdf?src-supplier=Digi-Key; ComponentLink5Description: https://datasheet.ciiva.com/22696/60838-22696216.pdf?src-supplier=Element14; ComponentLink4URL: https://datasheet.ciiva.com/2901/b3u-1110-2901099.pdf?src-supplier=Digi-Key; Weight: 0.022g; ComponentLink3Description: https://datasheet.ciiva.com/2901/b3u-1110-2901098.pdf?src-supplier=Digi-Key; Termination: SMD/SMT; Stock 1: 18128; ComponentLink2URL: https://datasheet.ciiva.com/2901/b3u-1110-2901097.pdf?src-supplier=Digi-Key; Depth: 4mm; Pricing 1: 1=1.01000, 10=0.97300, 25=0.90960, 100=0.78980, 250=0.71864, 500=0.66626, 1000=0.65502 (USD); ComponentLink6URL: https://datasheet.ciiva.com/14142/b3u-eng-datasheet-14142541.pdf?src-supplier=Distrelec; ComponentLink1Description: https://datasheet.ciiva.com/1634/60838-1634404.pdf?src-supplier=Farnell
SW5 = CMP-012-000000-1: Switch DIP OFF ON SPST 6 Raised Slide 0.025A 24VDC Gull Wing 1000Cycles 2.54mm SMD Tube; Manufacturer: Omron; Washable: No; Number of Positions: 6; Pitch: 0.1inch; Actuator Type: Slide (Standard); Voltage Rating (DC): 24V; Contact Current Rating: 25mA; Contact Resistance: 200mR; Actuator Length: 0.7mm; Terminal Pitch: 2.54mm; Length: 0.637inch; Lead Free: Lead Free; Contact Plating: Gold; Max Operating Temperature: 70°C; REACH SVHC: No SVHC; Package Quantity: 28; Throw Configuration: SPST; Number of Circuits: 6; Case/Package: DIP; Min Operating Temperature: -20°C; Packaging: Rail/Tube; Mechanical Life: 1000Cycles; Max Voltage Rating (DC): 24V; RoHS Compliant: Yes; Orientation: Straight; Mount: Surface Mount; Max Current Rating: 25mA; Series: A6S-H; Weight: 0.58g; Contact Material: Gold; Current Rating: 25mA; Electrical Life: 1000Cycles; Termination: Gull Wing; Design Item ID: A6S-6104-H; Stock 1: 140; ComponentLink1Description: https://datasheet.ciiva.com/2864/a6s-h-1110-2864087.pdf?src-supplier=Digi-Key; Pricing 1: 1=2.83000, 10=2.66900, 28=2.42607, 56=2.25268, 84=2.10250, 252=1.90615, 448=1.76752, 952=1.64045, 4900=1.38630 (USD); Source: ICNS_PropheseeLib.SchLib; ComponentLink3URL: https://datasheet.ciiva.com/16198/en-a6s-16198968.pdf?src-supplier=Onlinecomponents.com; ComponentLink1URL: https://datasheet.ciiva.com/2864/a6s-h-1110-2864087.pdf?src-supplier=Digi-Key; ComponentLink2Description: https://datasheet.ciiva.com/30215/en-a6s-30215103.pdf?src-supplier=Onlinecomponents.com; Category: DIP Switches; ComponentLink3Description: https://datasheet.ciiva.com/16198/en-a6s-16198968.pdf?src-supplier=Onlinecomponents.com; Manufacturer Part Number: A6S-6104-H; ComponentLink2URL: https://datasheet.ciiva.com/30215/en-a6s-30215103.pdf?src-supplier=Onlinecomponents.com; RoHS: Yes
U1 = CMP-005-000007-1: Cyclone V SE Family FPGA, 1.07 to 1.13 V Supply, 145 I/O Pins, 6 PLLs, 672-Pin UBGA, Speed Grade 7, Industrial Grade, RoHS Compliant; Manufacturer: Altera; Speed Grade: 7; Logic Elements (LE) (K): 110; NexusDeviceID: 5CSEBA6U23I7N; Voltage Supply: 1.07 to 1.13 V; ComponentLink5Description: Device Pin-Out URL; ComponentLink3URL: http://www.altera.com/devicepackaging/04R00437-01.pdf; Code_JEDEC: MO-216; ComponentLink1URL: http://www.altera.com; DatasheetVersion: Rev. 3.4; ComponentLink6Description: Product URL; PackageReference: UBGA672_A-185; PackageDescription: 672-Pin Ultra FineLine Ball-Grid Array (UBGA), Body 23 x 23 mm, Pitch 0.8 mm; PackageVersion: Rev. 2.0, 12/2012; ComponentLink5URL: http://www.altera.com/literature/dp/cyclone-v/5CSEBA6.xls; ComponentLink4URL: http://www.altera.com/literature/hb/cyclone-v/cyclone5_handbook.pdf; ComponentLink4Description: Device Handbook URL; PartNumber: 5CSEBA6U23I7N; ComponentLink2URL: http://www.altera.com/literature/hb/cyclone-v/cv_51002.pdf; ComponentLink1Description: Manufacturer URL; RoHS: RoHS Compliant; Device Group: 5CSEBA6; ComponentLink3Description: Package Specification; ComponentLink2Description: Datasheet; Subcategory: Cyclone V SE; ComponentLink6URL: http://www.buyaltera.com/scripts/partsearch.dll?Detail&name=5CSEBA6U23I7N-ND; Mounting Technology: Surface Mount; Design Item ID: 5CSEBA6U23I7N; Source: ICNS_PropheseeLib.SchLib
U17 U18 = CMP-008-000003-6: Volt Supervisor Supply Voltage Supervisory 0.914V 6.5V 4-Pin X2SON T/R; Manufacturer: Texas Instruments; Min Supply Voltage: 600mV; Watchdog Timer: No; Threshold Voltage: 900mV; Number of Voltages Monitored: 1; Reset Timeout: 120ms; Max Reset Threshold Voltage: 914mV; Reset Delay Time: 200ms; Min Reset Threshold Voltage: 874mV; Quiescent Current: 150nA; Reset: Active Low; Max Supply Current: 500nA; Type: Simple Reset/Power-On Reset; Manufacturer Part Number: TPS3831A09DQNR; Lead Free: Lead Free; Stock 1: 98; Pricing 1: 1=1.05000, 10=0.94100, 25=0.89320 (USD); RoHS Compliant: Yes; Category: Voltage Supervisors; Packaging: Tape and Reel; Max Operating Temperature: 85°C; ComponentLink1URL: https://datasheet.ciiva.com/18554/tps3831a09-18554236.pdf?src-supplier=Digi-Key; Max Supply Voltage: 6.5V; Source: ICNS_PropheseeLib.SchLib; Number of Pins: 4; Radiation Hardening: No; ComponentLink1Description: https://datasheet.ciiva.com/18554/tps3831a09-18554236.pdf?src-supplier=Digi-Key; Number of Monitored Inputs: 1; RoHS: Yes; Operating Supply Current: 150nA; Mount: Surface Mount; Package Quantity: 3000; Design Item ID: TPS3831A09DQNR; Min Operating Temperature: -40°C